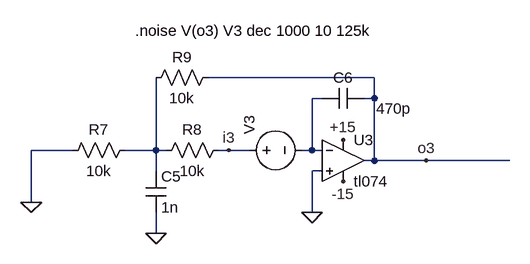
[diagram p0: schematic filtro ruido o3.asc]
filtro ruido o3.asc, the LTspice schematic file:
Version 4
SHEET 1 1900 680
WIRE 16 -976 -240 -976
WIRE -64 -944 -80 -944
WIRE 16 -944 16 -976
WIRE 16 -944 0 -944
WIRE -448 -864 -512 -864
WIRE -320 -864 -320 -976
WIRE -320 -864 -368 -864
WIRE -304 -864 -320 -864
WIRE -208 -864 -224 -864
WIRE -176 -864 -208 -864
WIRE -80 -864 -80 -944
WIRE -80 -864 -96 -864
WIRE -64 -864 -80 -864
WIRE 16 -848 16 -944
WIRE 16 -848 0 -848
WIRE 96 -848 16 -848
WIRE 224 -848 96 -848
WIRE -320 -832 -320 -864
WIRE -64 -832 -80 -832
WIRE -512 -784 -512 -864
WIRE -80 -768 -80 -832
WIRE -320 -736 -320 -768
FLAG -80 -768 0
FLAG -320 -736 0
FLAG -32 -880 +15
FLAG -32 -816 -15
FLAG -512 -784 0
FLAG -208 -864 i3
FLAG 96 -848 o3
SYMBOL res -464 -848 R270
WINDOW 0 32 56 VTop 2
WINDOW 3 0 56 VBottom 2
SYMATTR InstName R7
SYMATTR Value 10k
SYMBOL cap -336 -832 R0
SYMATTR InstName C5
SYMATTR Value 1n
SYMBOL res -320 -848 R270
WINDOW 0 32 56 VTop 2
WINDOW 3 0 56 VBottom 2
SYMATTR InstName R8
SYMATTR Value 10k
SYMBOL res -336 -960 R270
WINDOW 0 32 56 VTop 2
WINDOW 3 0 56 VBottom 2
SYMATTR InstName R9
SYMATTR Value 10k
SYMBOL cap -64 -928 R270
WINDOW 0 32 32 VTop 2
WINDOW 3 16 110 VBottom 2
SYMATTR InstName C6
SYMATTR Value 470p
SYMBOL tl074\\tl074 -32 -912 R0
SYMATTR InstName U3
SYMBOL voltage -192 -864 R270
WINDOW 123 24 44 Left 2
WINDOW 39 0 0 Left 2
SYMATTR InstName V3
SYMATTR Value ""
TEXT -352 -1048 Left 2 !.noise V(o3) V3 dec 1000 10 125k

The netlist it stands for:
* filtro ruido o3.asc
R7 0 N002 10k
C5 N002 0 1n
R8 N002 i3 10k
R9 N002 o3 10k
C6 N001 o3 470p
* U3: tl074 (symbol tl074\tl074 not available, pins judged from their places): In+=0 In-=N001 V+=+15 V-=-15 OUT=o3
V3 i3 N001
.noise V(o3) V3 dec 1000 10 125k
.backanno
.end